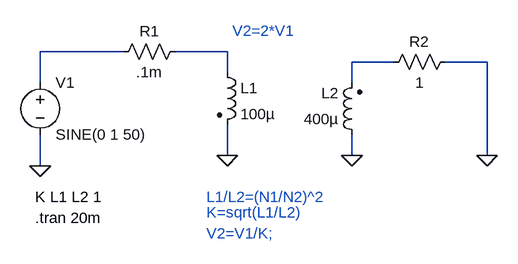
[diagram p0: schematic transformer.asc]
transformer.asc, the LTspice schematic file:
Version 4
SHEET 1 880 680
WIRE 208 80 80 80
WIRE 368 80 288 80
WIRE 624 96 560 96
WIRE 768 96 704 96
WIRE 368 112 368 80
WIRE 80 128 80 80
WIRE 560 128 560 96
WIRE 368 240 368 192
WIRE 560 240 560 208
WIRE 768 240 768 96
WIRE 80 256 80 208
FLAG 560 240 0
FLAG 368 240 0
FLAG 80 256 0
FLAG 768 240 0
SYMBOL voltage 80 112 R0
SYMATTR InstName V1
SYMATTR Value SINE(0 1 50)
SYMBOL res 304 64 R90
WINDOW 0 0 56 VBottom 2
WINDOW 3 32 56 VTop 2
SYMATTR InstName R1
SYMATTR Value .1m
SYMBOL ind2 352 96 R0
SYMATTR InstName L1
SYMATTR Value 100µ
SYMATTR Type ind
SYMBOL ind2 576 224 R180
WINDOW 0 36 80 Left 2
WINDOW 3 36 40 Left 2
SYMATTR InstName L2
SYMATTR Value 400µ
SYMATTR Type ind
SYMBOL res 720 80 R90
WINDOW 0 0 56 VBottom 2
WINDOW 3 32 56 VTop 2
SYMATTR InstName R2
SYMATTR Value 1
TEXT 72 304 Left 2 !K L1 L2 1
TEXT 336 304 Left 2 ;L1/L2=(N1/N2)^2
TEXT 376 48 Left 2 ;V2=2*V1
TEXT 336 328 Left 2 ;K=sqrt(L1/L2)
TEXT 336 360 Left 2 ;V2=V1/K;
TEXT 72 336 Left 2 !.tran 20m

The netlist it stands for:
* transformer.asc
V1 N001 0 SINE(0 1 50)
R1 N002 N001 .1m
L1 N002 0 100µ
L2 0 N003 400µ
R2 0 N003 1
K L1 L2 1
* L1/L2=(N1/N2)^2
* V2=2*V1
* K=sqrt(L1/L2)
* V2=V1/K;
.tran 20m
.backanno
.end